# EAGLE design eCog108_Keyfob (EAGLE 6.6.0)
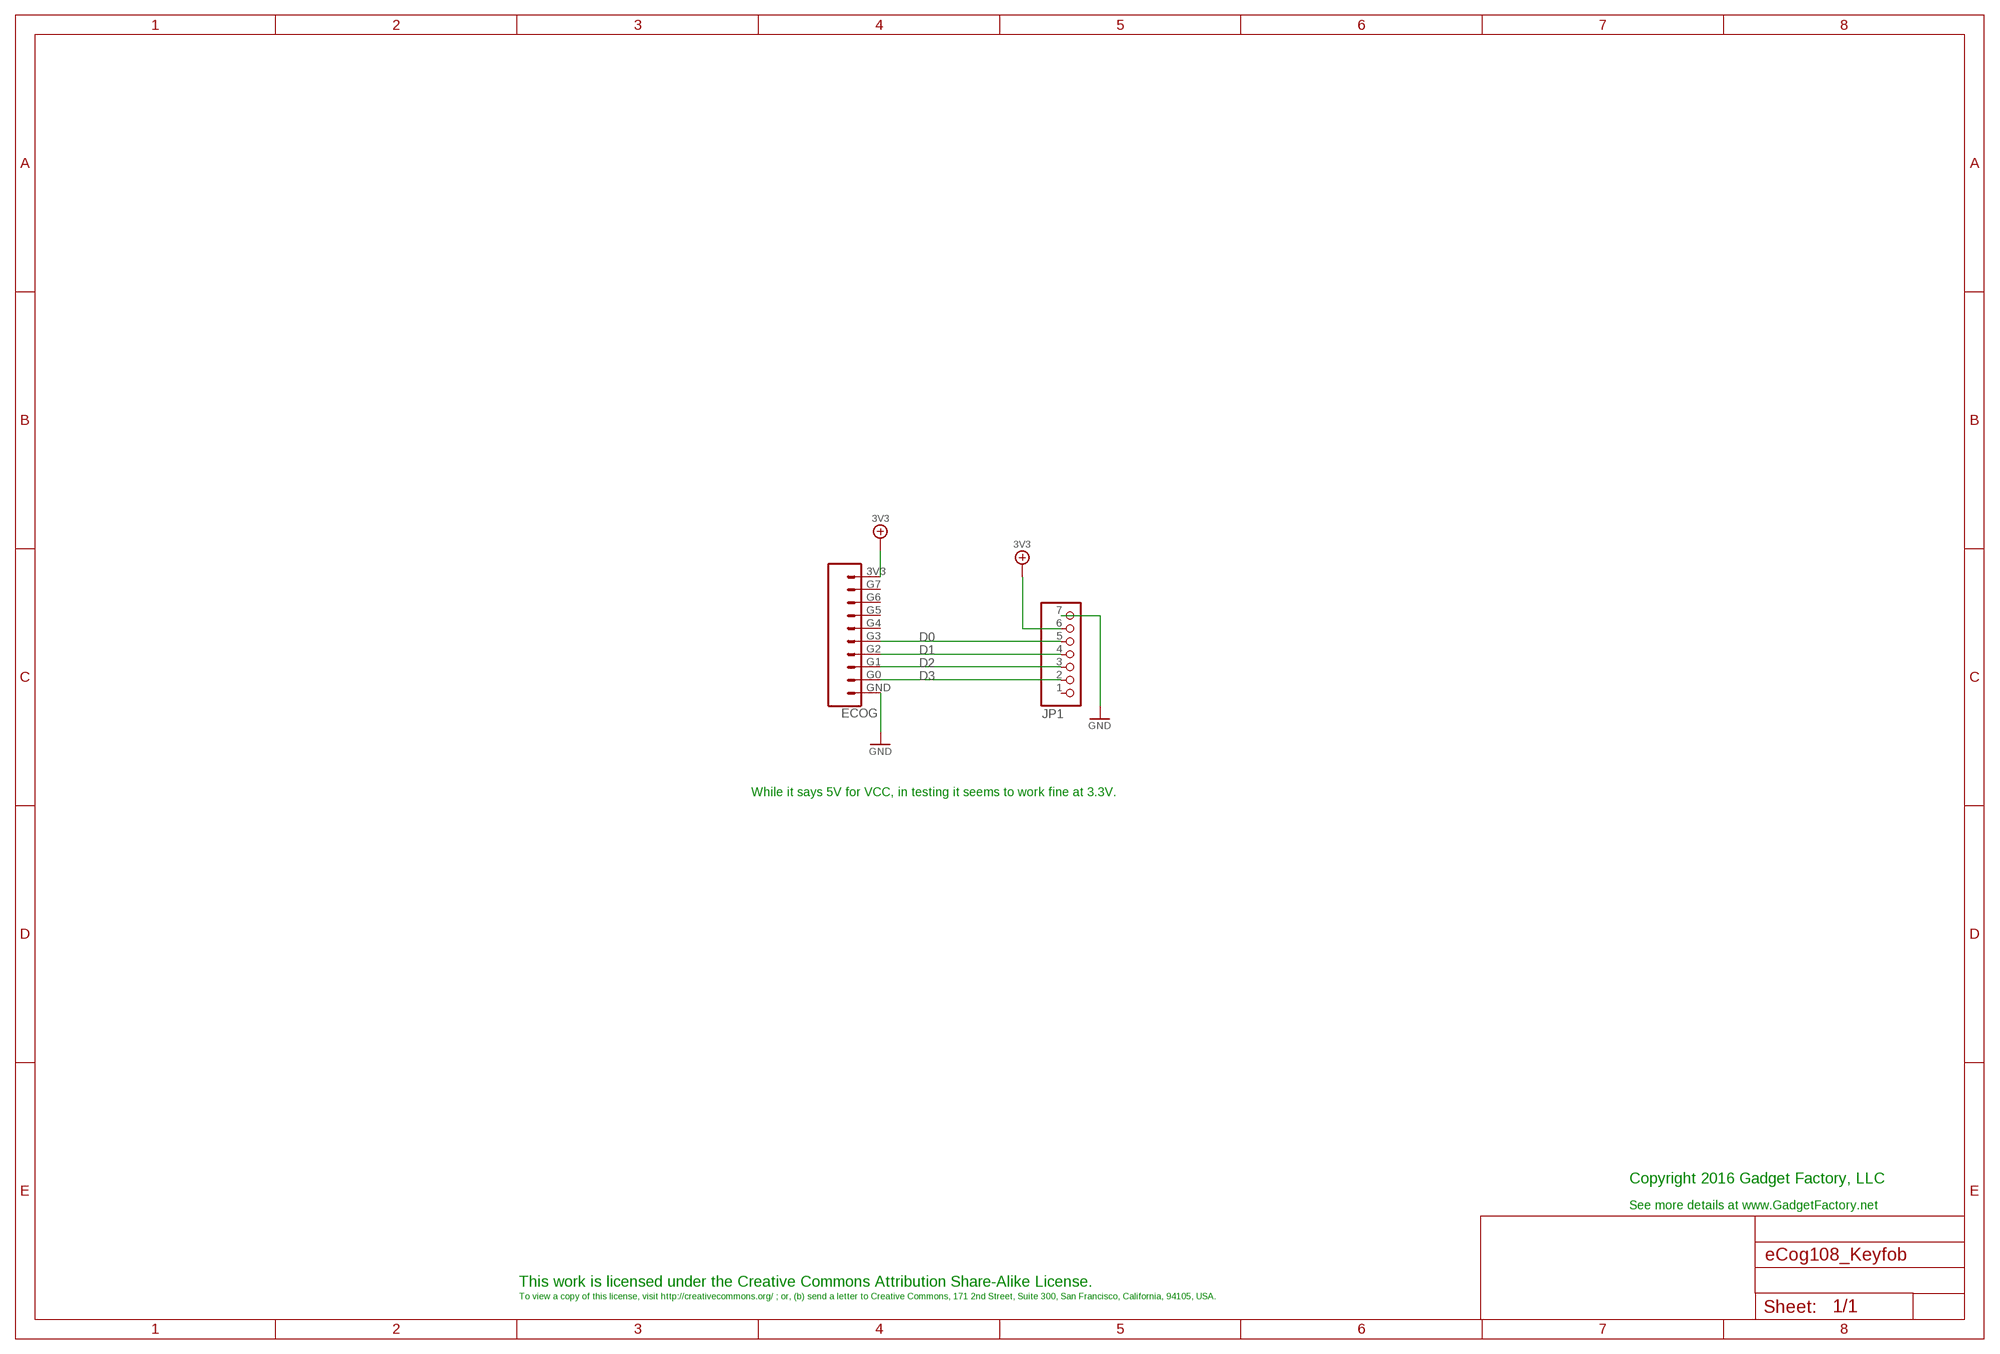
[diagram p0: schematic, sheet 1]

## Parts
ECOG  ECOG_GENERAL_ROWECOG_GENERAL_SMD  [ECOG_GENERAL_SMD]
JP1  PINHD-1X7  [1X07]

## Nets
3V3: ECOG.3V3 JP1.6
D0: ECOG.G3 JP1.5
D1: ECOG.G2 JP1.4
D2: ECOG.G1 JP1.3
D3: ECOG.G0 JP1.2
GND: ECOG.GND JP1.7
Unconnected: ECOG.G4 ECOG.G5 ECOG.G6 ECOG.G7 JP1.1

## Notes on the sheet
- While it says 5V for VCC, in testing it seems to work fine at 3.3V.
- Copyright 2016 Gadget Factory, LLC
- See more details at www.GadgetFactory.net
- This work is licensed under the Creative Commons Attribution Share-Alike License.
- To view a copy of this license, visit http://creativecommons.org/ ; or, (b) send a letter to Creative Commons, 171 2nd Street, Suite 300, San Francisco, California, 94105, USA.

## Library data of the parts
ECOG = eCogs:ECOG_GENERAL_ROW; DIGIKEY: S1013EC-10-ND
JP1 = pinhead:PINHD-1X7: PIN HEADER

## Board
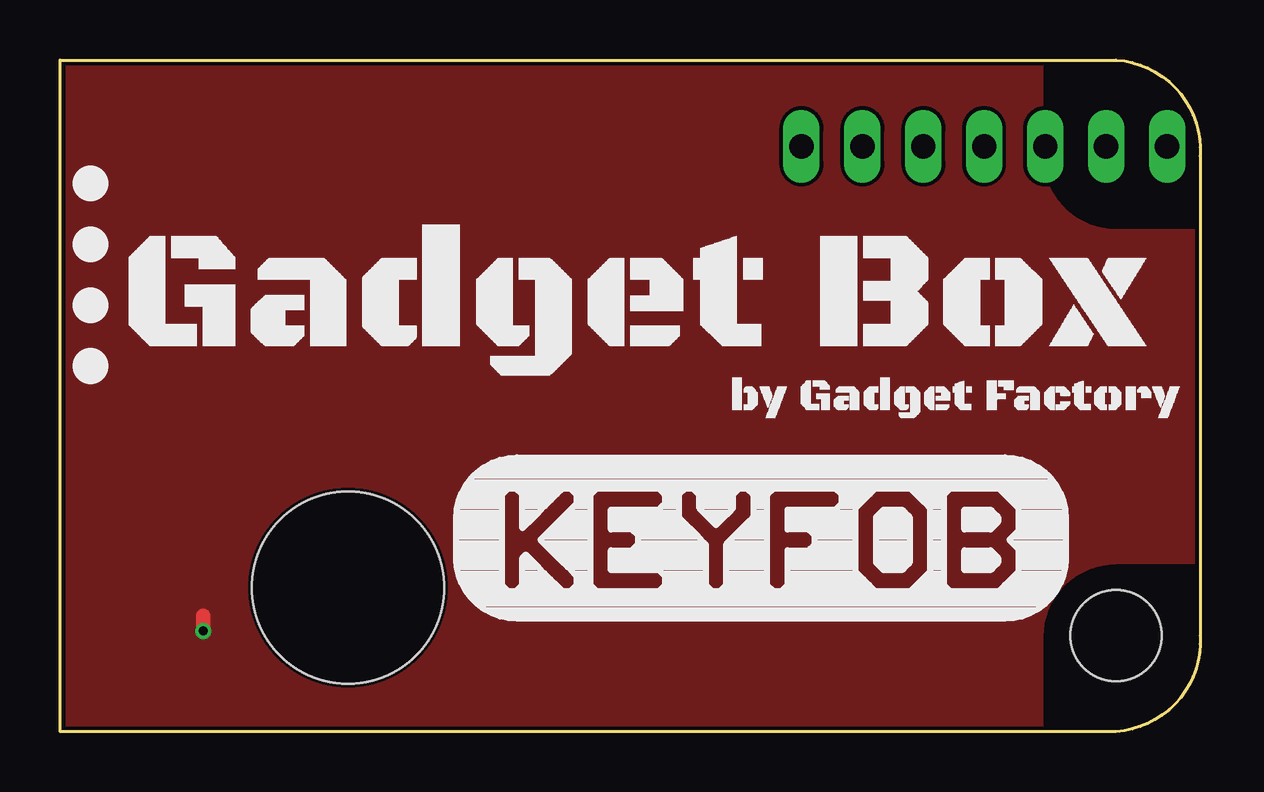
[diagram p1: board, top side]
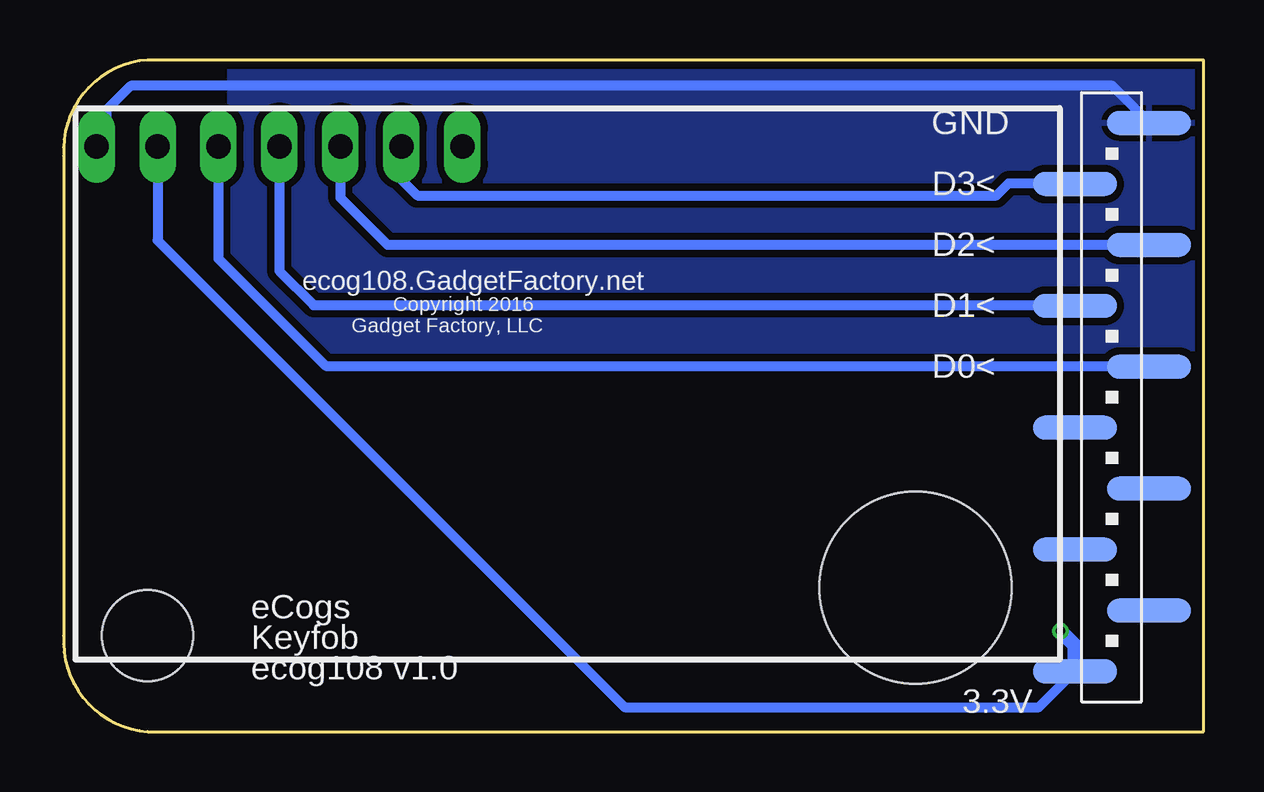
[diagram p2: board, bottom side, seen from below]

Size 47.51 x 28 mm. Coordinates in mm from the lower left corner, seen from the top.
Copper layers (1*16): Top 0.035mm / dielectric 1.5mm / Bottom 0.035mm
Design rules "hackvana *": minimum track width 6mil, minimum drill 0.3mm, track to track 6mil, track to pad 6mil, pad to pad 6mil, via to via 6mil, smd to smd 0mil, copper to edge 6mil, drill to drill 6mil, minimum pad ring 10mil, minimum via ring 6mil, stop-mask expansion 2mil, vias tented up to drill 100mil, thermal gap 10mil
Holes 8 mm at 12,6

### Footprints (pad centres in the part's own frame; a part is rotated, then mirrored left to right if it is on the bottom)
ECOG_GENERAL_SMD = smd 3.5 x 1 bottom: 3V3 5.369,2.51; G0 5.369,22.83; G1 2.271,20.29; G2 5.369,17.75; G3 2.271,15.21; G4 5.369,12.67; G5 2.271,10.13; G6 5.369,7.59; G7 2.271,5.05; GND 2.271,25.37 | hole 3.8: 44,4
1X07 = drill 1.016 long: 1 -7.62,0; 2 -5.08,0; 3 -2.54,0; 4 0,0; 5 2.54,0; 6 5.08,0; 7 7.62,0

### Placement (x,y rotation side)
ECOG  0,0 0 top
JP1  38.51,24.4 0 top
U$1  [GADGETBOX_TEXT]  24.13,17.78 0 top
U$2  [LEGEND_DIO]  1.27,22.86 0 top
U$3  [LEGEND_DIO]  1.27,20.32 0 top
U$4  [LEGEND_DIO]  1.27,17.78 0 top
U$5  [LEGEND_DIO]  1.27,15.24 0 top

### Tracks (layer width: path | path; a pad name or v marks a point on that pad's centre or on a via)
3V3  (via drill 0.38)
  Top 0.61: v5.97,4.19 5.97,4.83
  Bottom 0.406: JP1.6 43.59,20.48 24.13,1.02 6.86,1.02 ECOG.3V3
  Bottom 0.61: ECOG.3V3 5.37,3.59 v5.97,4.19
  pour Top: -1,29 49,29 49,-1 -1,-1
D0
  Bottom 0.406: JP1.5 41.05,19.71 36.58,15.24 2.3,15.24 ECOG.G3
D1
  Bottom 0.406: JP1.4 38.51,19.21 37.08,17.78 5.4,17.78 ECOG.G2
D2
  Bottom 0.406: JP1.3 35.97,22.25 34.01,20.29 ECOG.G1
D3
  Bottom 0.406: JP1.2 33.43,23.02 32.77,22.35 8.64,22.35 8.13,22.86 5.4,22.86 ECOG.G0
GND
  Bottom 0.406: ECOG.GND 2.27,25.39 3.81,26.92 44.7,26.92 45.72,25.91 45.72,24.81 JP1.7
  pour Bottom (isolate 0.305): -2,30 50,30 50,-2 -2,-2

### Text on the board
bPlace: GND | D3< | D2< | Copyright 2016 | ecog108.GadgetFactory.net | D1< | Gadget Factory, LLC | D0< | eCogs | Keyfob | ecog108 v1.0 | 3.3V